# EasyEDA schematic 1-Schematic_Scorpion-256-Turbo_v16.2.4.json
TITLE: Scorpion ZS 256 Turbo +; REV: 16.2.4; Date: 2022-06-06; Sheet: 1/1; Drawn By: Romych; Company: ZX-PK.RU
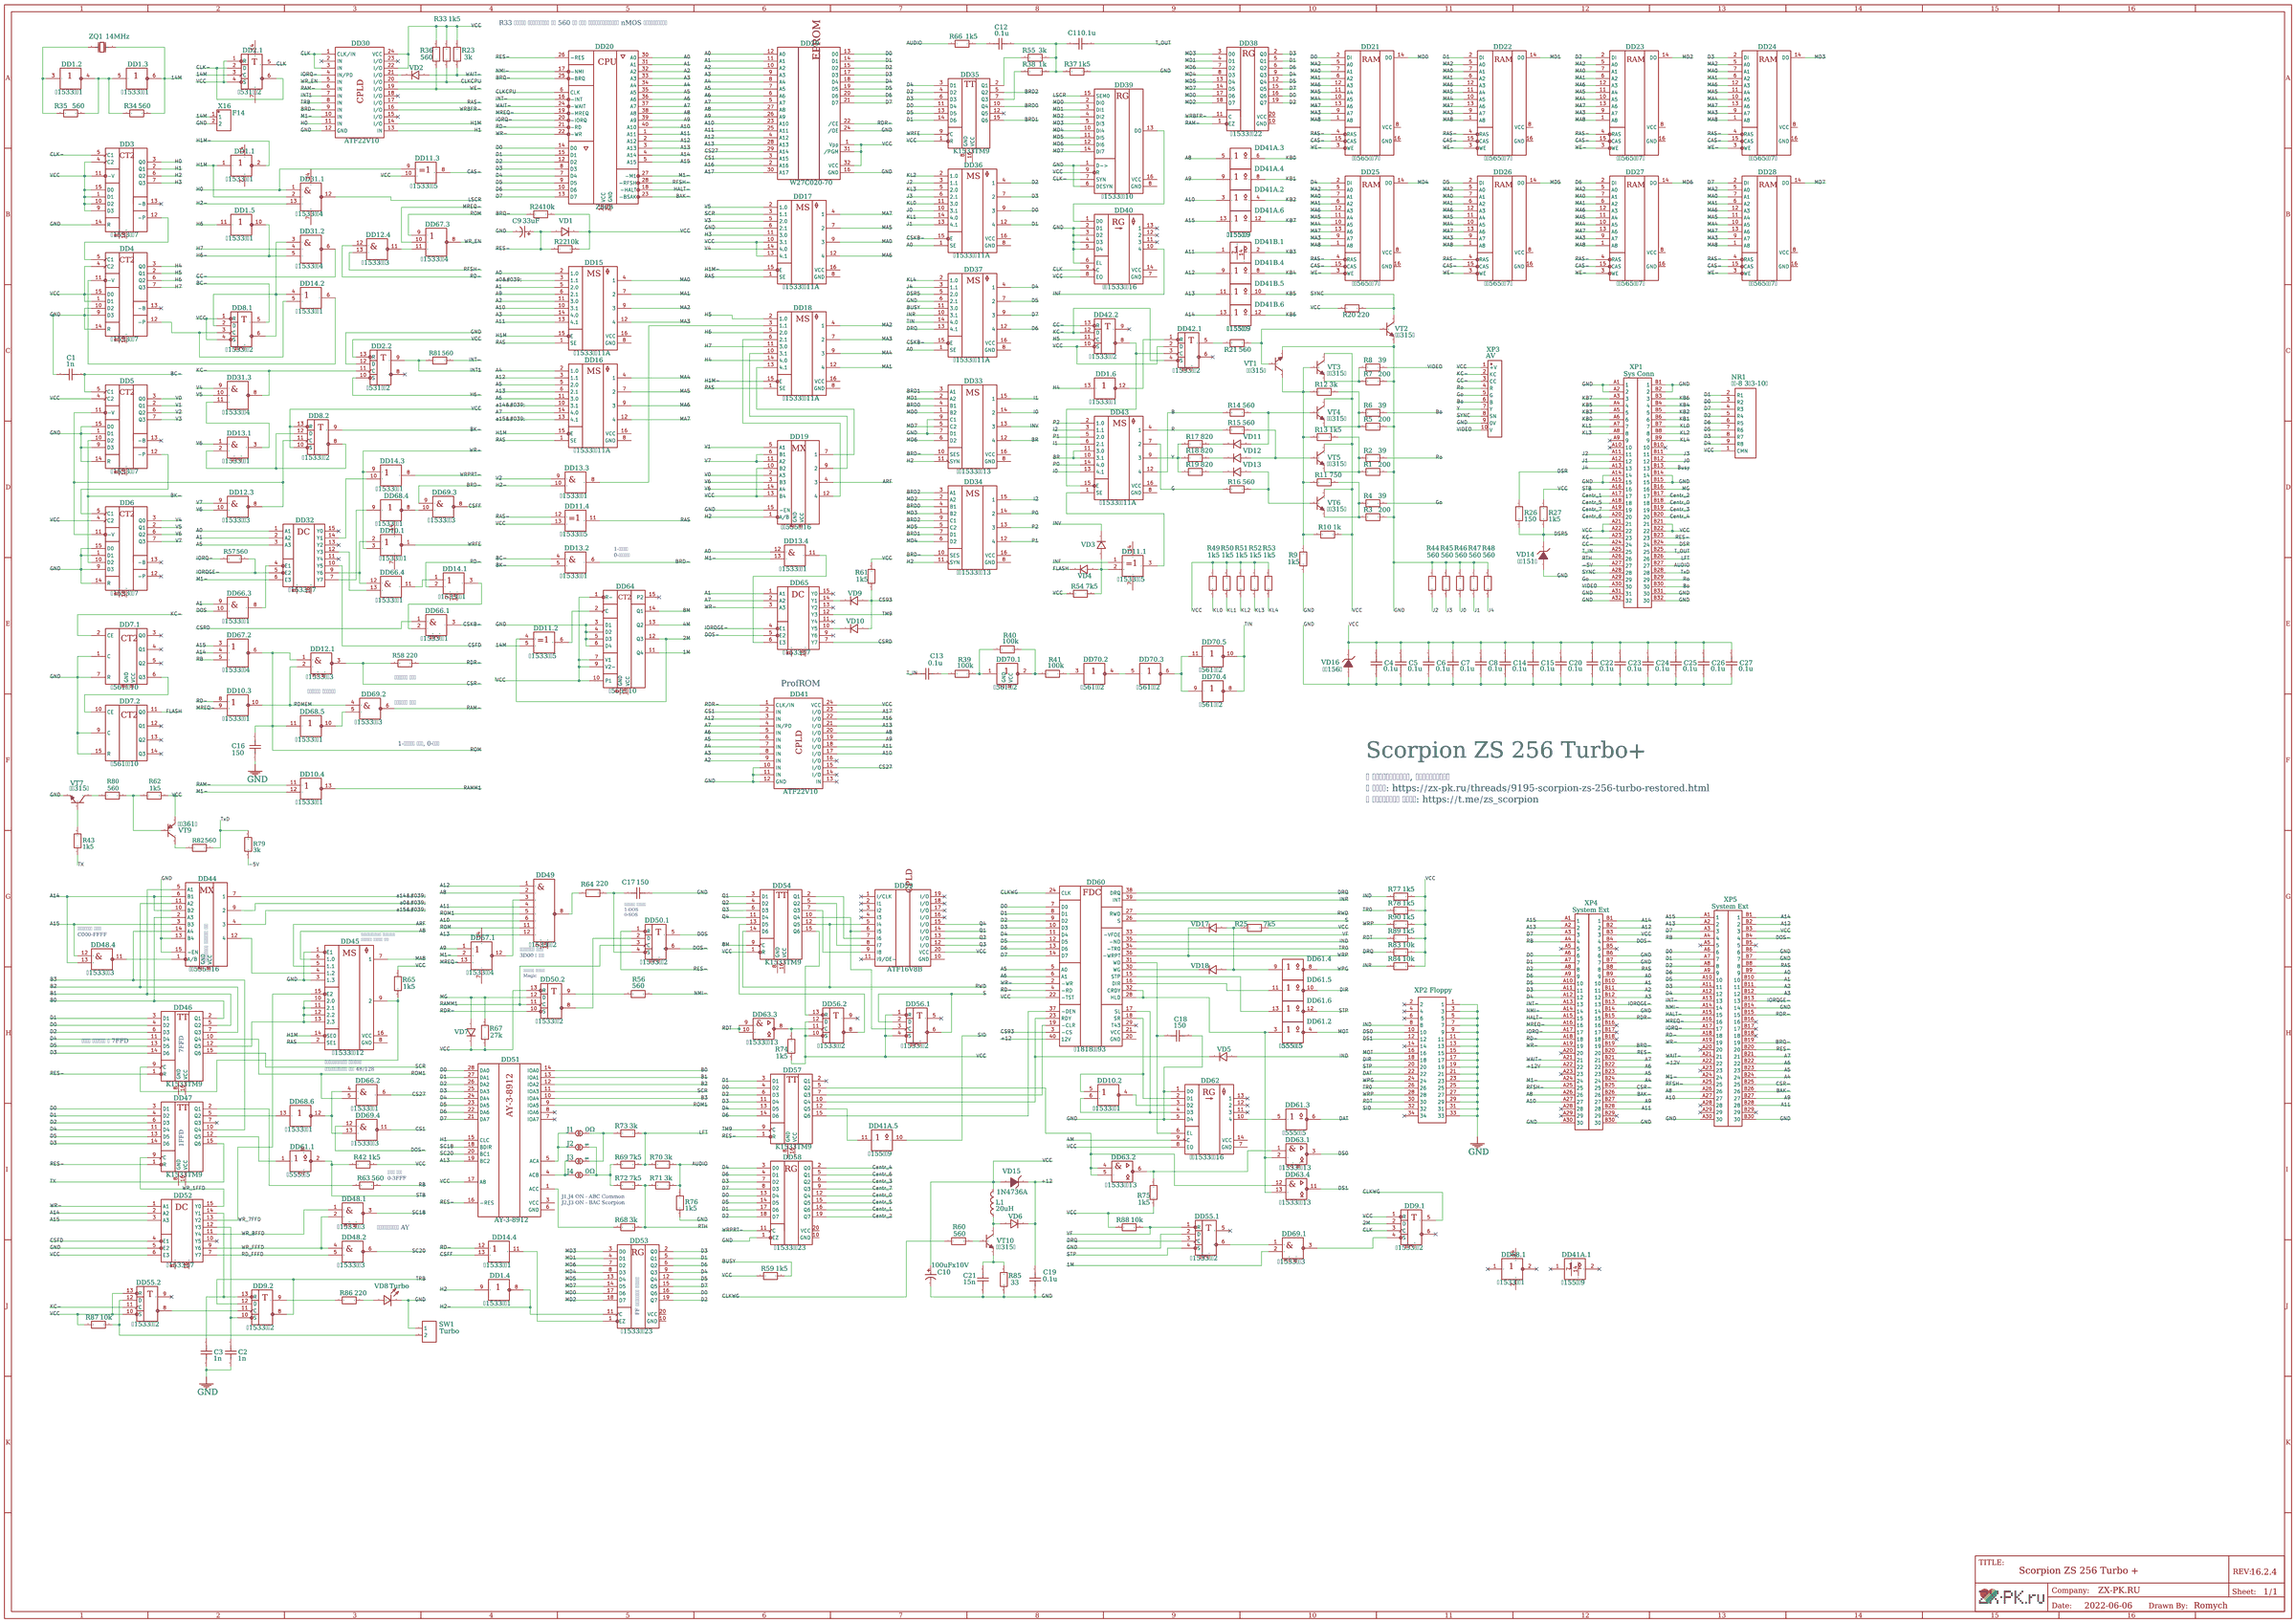
[diagram p0: schematic sheet]

## Parts
C1  1n  [CAP-TH_L5.08]
C2  1n  [CAP-TH_L5.08]
C3  1n  [CAP-TH_L5.08]
C4  0.1u  [CAP-TH_L5.08]
C5  0.1u  [CAP-TH_L5.08]
C6  0.1u  [CAP-TH_L5.08]
C7  0.1u  [CAP-TH_L5.08]
C8  0.1u  [CAP-TH_L5.08]
C9  33uF  [CAP-TH_BD5.0-P2.50-D1.0-FD]
C10  100uFx10V  [CAP-TH_BD6.3-P2.50-D1.0-FD]
C11  0.1u  [CAP-TH_L5.08]
C12  0.1u  [CAP-TH_L5.08]
C13  0.1u  [CAP-TH_L5.08]
C14  0.1u  [CAP-TH_L5.08]
C15  0.1u  [CAP-TH_L5.08]
C16  150  [CAP-TH_L5.08]
C17  150  [CAP-TH_L5.08]
C18  150  [CAP-TH_L5.08]
C19  0.1u  [CAP-TH_L5.08]
C20  0.1u  [CAP-TH_L5.08]
C21  15n  [CAP-TH_L5.08]
C22  0.1u  [CAP-TH_L5.08]
C23  0.1u  [CAP-TH_L5.08]
C24  0.1u  [CAP-TH_L5.08]
C25  0.1u  [CAP-TH_L5.08]
C26  0.1u  [CAP-TH_L5.08]
C27  0.1u  [CAP-TH_L5.08]
DD1  К1533ЛН1  [DIP-14_STD]  (sections 1,2,3,4,5,6)
DD2  К531ТМ2  [DIP-14_STD]  (sections 1,2)
DD3  К1533ИЕ7  [DIP-16_STD]
DD4  К1533ИЕ7  [DIP-16_STD]
DD5  К1533ИЕ7  [DIP-16_STD]
DD6  К1533ИЕ7  [DIP-16_STD]
DD7  К561ИЕ10  [DIP-16_STD]  (sections 1,2)
DD8  К1533ТМ2  [DIP-14_STD]  (sections 1,2)
DD9  К1533ТМ2  [DIP-14_STD]  (sections 1,2)
DD10  К1533ЛЕ1  [DIP-14_STD]  (sections 1,2,3,4)
DD11  К1533ЛП5  [DIP-14_STD]  (sections 1,2,3,4)
DD12  К1533ЛА3  [DIP-14_STD]  (sections 1,3,4)
DD13  К1533ЛИ1  [DIP-14_STD]  (sections 1,2,3,4)
DD14  К1533ЛЛ1  [DIP-14_STD]  (sections 1,2,3,4)
DD15  К1533КП11A  [DIP-16_STD]
DD16  К1533КП11A  [DIP-16_STD]
DD17  К1533КП11A  [DIP-16_STD]
DD18  К1533КП11A  [DIP-16_STD]
DD19  КР555КП16  [DIP-16_STD]
DD20  Z80B  [DIP-40_STD]
DD21  КР565РУ7Г  [DIP-16_STD]
DD22  КР565РУ7Г  [DIP-16_STD]
DD23  КР565РУ7Г  [DIP-16_STD]
DD24  КР565РУ7Г  [DIP-16_STD]
DD25  КР565РУ7Г  [DIP-16_STD]
DD26  КР565РУ7Г  [DIP-16_STD]
DD27  КР565РУ7Г  [DIP-16_STD]
DD28  КР565РУ7Г  [DIP-16_STD]
DD29  W27C020-70  [DIP-32_STD_S]
DD30  ATF22V10  [DIP-24_L30.5-W10.2-P2.54-LS7.62-BL]
DD31  К1533ЛА4  [DIP-14_STD]  (sections 1,2,3)
DD32  К1533ИД7  [DIP-16_STD]
DD33  КР1533КП13  [DIP-16_STD]
DD34  КР1533КП13  [DIP-16_STD]
DD35  K1533TM9  [DIP-16_STD]
DD36  К1533КП11A  [DIP-16_STD]
DD37  К1533КП11A  [DIP-16_STD]
DD38  К1533ИР22  [DIP-20_STD_P7.2]
DD39  К1533ИР10  [DIP-16_STD]
DD40  КР1533ИР16  [DIP-14_STD]
DD41  ATF22V10  [DIP-24_L30.5-W10.2-P2.54-LS7.62-BL]
DD41A.1  К155ЛП9  [DIP-14_STD]
DD41A.2  К155ЛП9  [DIP-14_STD]
DD41A.3  К155ЛП9  [DIP-14_STD]
DD41A.4  К155ЛП9  [DIP-14_STD]
DD41A.5  К155ЛП9  [DIP-14_STD]
DD41A.6  К155ЛП9  [DIP-14_STD]
DD41B.1  К155ЛП9  [DIP-14_STD]
DD41B.4  К155ЛП9  [DIP-14_STD]
DD41B.5  К155ЛП9  [DIP-14_STD]
DD41B.6  К155ЛП9  [DIP-14_STD]
DD42  К1533ТМ2  [DIP-14_STD]  (sections 1,2)
DD43  К1533КП11A  [DIP-16_STD]
DD44  КР555КП16  [DIP-16_STD]
DD45  К1533КП12  [DIP-16_STD]
DD46  K1533TM9  [DIP-16_STD]
DD47  K1533TM9  [DIP-16_STD]
DD48  К1533ЛА3  [DIP-14_STD]  (sections 1,2,4)
DD49  К1533ЛА2  [DIP-14_STD]
DD50  К1533ТМ2  [DIP-14_STD]  (sections 1,2)
DD51  AY-3-8912  [DIP-28_STD]
DD52  К1533ИД7  [DIP-16_STD]
DD53  К1533ИР23  [DIP-20_STD_P7.2]
DD54  K1533TM9  [DIP-16_STD]
DD55  К1533ТМ2  [DIP-14_STD]  (sections 1,2)
DD56  К1533ТМ2  [DIP-14_STD]  (sections 1,2)
DD57  K1533TM9  [DIP-16_STD]
DD58  К1533ИР23  [DIP-20_STD_P7.2]
DD59  ATF16V8B  [DIP-20_STD]
DD60  К1818ВГ93  [DIP-40_STD]
DD61  К555ЛН5  [DIP-14_STD]  (sections 1,2,3,4,5,6)
DD62  КР1533ИР16  [DIP-14_STD]
DD63  К1533ЛА13  [DIP-14_STD]  (sections 1,2,3,4)
DD64  К555ИЕ10  [DIP-16_STD]
DD65  К1533ИД7  [DIP-16_STD]
DD66  К1533ЛИ1  [DIP-14_STD]  (sections 1,2,3,4)
DD67  К1533ЛЕ4  [DIP-14_STD]  (sections 1,2,3)
DD68  К1533ЛН1  [DIP-14_STD]  (sections 1,4,5,6)
DD69  К1533ЛА3  [DIP-14_STD]  (sections 1,2,3,4)
DD70  К561ЛН2  [DIP-14_STD]  (sections 1,2,3,4,5)
J1  0Ω  [JUMP_0603]
J2  ∞  [JUMP_0603]
J3  ∞  [JUMP_0603]
J4  0Ω  [JUMP_0603]
L1  20uH  [L-TH_L5.08]
NR1  НР-8 3к3-10к  [HDR-TH_9P-P2.54-V-F]
R1  200  [R_0.125_7.62]
R2  39  [R_0.125_7.62]
R3  200  [R_0.125_7.62]
R4  39  [R_0.125_7.62]
R5  200  [R_0.125_7.62]
R6  39  [R_0.125_7.62]
R7  200  [R_0.125_7.62]
R8  39  [R_0.125_7.62]
R9  1k5  [R_0.125_7.62]
R10  1k  [R_0.125_7.62]
R11  750  [R_0.125_7.62]
R12  3k  [R_0.125_7.62]
R13  1k5  [R_0.125_7.62]
R14  560  [R_0.125_7.62]
R15  560  [R_0.125_7.62]
R16  560  [R_0.125_7.62]
R17  820  [R_0.125_7.62]
R18  820  [R_0.125_7.62]
R19  820  [R_0.125_7.62]
R20  220  [R_0.125_7.62]
R21  560  [R_0.125_7.62]
R22  10k  [R_0.125_7.62]
R23  3k  [R_0.125_7.62]
R24  10k  [R_0.125_7.62]
R25  7k5  [R_0.125_7.62]
R26  150  [R_0.125_7.62]
R27  1k5  [R_0.125_7.62]
R33  1k5  [R_0.125_7.62]
R34  560  [R_0.125_7.62]
R35  560  [R_0.125_7.62]
R36  560  [R_0.125_7.62]
R37  1k5  [R_0.125_7.62]
R38  1k  [R_0.125_7.62]
R39  100k  [R_0.125_7.62]
R40  100k  [R_0.125_7.62]
R41  100k  [R_0.125_7.62]
R42  1k5  [R_0.125_7.62]
R43  1k5  [R_0.125_7.62]
R44  560  [R_0.125_7.62]
R45  560  [R_0.125_7.62]
R46  560  [R_0.125_7.62]
R47  560  [R_0.125_7.62]
R48  560  [R_0.125_7.62]
R49  1k5  [R_0.125_7.62]
R50  1k5  [R_0.125_7.62]
R51  1k5  [R_0.125_7.62]
R52  1k5  [R_0.125_7.62]
R53  1k5  [R_0.125_7.62]
R54  7k5  [R_0.125_7.62]
R55  3k  [R_0.125_7.62]
R56  560  [R_0.125_7.62]
R57  560  [R_0.125_7.62]
R58  220  [R_0.125_7.62]
R59  1k5  [R_0.125_7.62]
R60  560  [R_0.125_7.62]
R61  1k5  [R_0.125_7.62]
R62  1k5  [R_0.125_7.62]
R63  560  [R_0.125_7.62]
R64  220  [R_0.125_7.62]
R65  1k5  [R_0.125_7.62]
R66  1k5  [R_0.125_7.62]
R67  27k  [R_0.125_7.62]
R68  3k  [R_0.125_7.62]
R69  7k5  [R_0.125_7.62]
R70  3k  [R_0.125_7.62]
R71  3k  [R_0.125_7.62]
R72  7k5  [R_0.125_7.62]
R73  3k  [R_0.125_7.62]
R74  1k5  [R_0.125_7.62]
R75  1k5  [R_0.125_7.62]
R76  1k5  [R_0.125_7.62]
R77  1k5  [R_0.125_7.62]
R78  1k5  [R_0.125_7.62]
R79  3k  [R_0.125_7.62]
R80  560  [R_0.125_7.62]
R81  560  [R_0.125_7.62]
R82  560  [R_0.125_7.62]
R83  10k  [R_0.125_7.62]
R84  10k  [R_0.125_7.62]
R85  33  [R_0.125_7.62]
R86  220  [R_0.125_7.62]
R87  10k  [R_0.125_7.62]
R88  10k  [R_0.125_7.62]
R89  1k5  [R_0.125_7.62]
R90  1k5  [R_0.125_7.62]
SW1  Turbo  [HDR-F-2.54_1X2]
VD1  1N4148  [D_TH_7.62]
VD2  1N4148  [D_TH_7.62]
VD3  1N4148  [D_TH_7.62]
VD4  1N4148  [D_TH_7.62]
VD5  1N4148  [D_TH_7.62]
VD6  1N4148  [D-TH_L10.16]
VD7  1N4148  [D_TH_7.62]
VD8  Turbo  [D-TH_L2.54]
VD9  1N4148  [D-TH_L11.43]
VD10  1N4148  [D_TH_7.62]
VD11  1N4148  [D_TH_7.62]
VD12  1N4148  [D_TH_7.62]
VD13  1N4148  [D_TH_7.62]
VD14  КС151А  [D_TH_7.62]
VD15  1N4736A  [D-TH_L8.89]
VD16  КС156А  [D_TH_7.62]
VD17  1N4148  [D_TH_7.62]
VD18  1N4148  [D_TH_7.62]
VT1  КТ315Б  [KT315_STD]
VT2  КТ315Б  [KT315_STD]
VT3  КТ315Б  [KT315_STD]
VT4  КТ315Б  [KT315_STD]
VT5  КТ315Б  [KT315_STD]
VT6  КТ315Б  [KT315_STD]
VT7  КТ315Б  [KT315_STD]
VT9  КТ361Б  [KT315_STD]
VT10  КТ315Б  [KT315_STD]
X16  F14  [HDR-TH_2P-P2.54-M]
XP1  Sys Conn  [HDR-TH_64P_P2.54_R2]
XP2  Floppy  [IDC-TH_Z-231011834106]
XP3  AV  [HDR-TH_10P-P2.54-V-M]
XP4  System Ext  [SL62_P2.54_R2]
XP5  System Ext  [SL62_P2.54_R2]
ZQ1  14MHz  [OSC-49U-1]

## Library data of the parts
C1-C8 C11-C27 = CK45-R3AD152K-VRY: Supplier: LCSC; Supplier Part: C340608; Manufacturer: TDK; Contributor: LCSC
C9 C10 = ECLJ0612220M101P00: Supplier: LCSC; Supplier Part: C156809; Manufacturer: Guangdong TOPAZ Elec Tech; Contributor: LCSC
DD1 DD68 = К1533ЛН1: Supplier: chipdip; Contributor: Roman Boykov; subpart_no: 7
DD2 = К531ТМ2: Supplier: chipdip; Contributor: Roman Boykov; subpart_no: 1
DD3-DD6 = К1533ИЕ7: Contributor: romychs_4693
DD7 = К561ИЕ10: Supplier: chipdip; Contributor: romychs_4693; subpart_no: 1
DD8 DD9 DD42 DD50 DD55 DD56 = К1533ТМ2: Supplier: chipdip; Contributor: romychs_4693; subpart_no: 3
DD10 = К1533ЛЕ1: Supplier: chipdip; Contributor: Roman Boykov; subpart_no: 1
DD11 = К1533ЛП5: Supplier: chipdip; Contributor: Roman Boykov; subpart_no: 1
DD12 DD48 DD69 = К1533ЛА3: Supplier: chipdip; Contributor: Roman Boykov; subpart_no: 1
DD13 DD66 = К1533ЛИ1: Supplier: chipdip; Contributor: Roman Boykov; subpart_no: 1
DD14 = К1533ЛЛ1: Supplier: chipdip; Contributor: Roman Boykov; subpart_no: 1
DD15-DD18 DD36 DD37 DD43 = К1533КП11A: Supplier: chipdip; Contributor: Roman Boykov
DD19 DD44 = КР555КП16: Supplier: chipdip; Contributor: romychs_4693
DD20 = Z80B: Manufacturer: Zilog; Contributor: romychs_4693
DD21-DD28 = КР565РУ7Г: Supplier: chipdip; Contributor: Roman Boykov
DD29 = W27C020-70: Contributor: romychs_4693
DD30 DD41 = ATF22V10: Manufacturer: Microchip; Contributor: romychs_4693
DD31 = К1533ЛА4: Supplier: chipdip; Contributor: Roman Boykov; subpart_no: 1
DD32 DD52 DD65 = К1533ИД7: Supplier: chipdip; Contributor: romychs_4693; subpart_no: 4
DD33 DD34 = КР1533КП13: Supplier: chipdip; Contributor: romychs_4693
DD35 DD46 DD47 DD54 DD57 = K1533TM9: Supplier: chipdip; Contributor: Roman Boykov
DD38 = К1533ИР22: Supplier: chipdip; link: TTL; Регистр; ИР22; Contributor: Roman Boykov
DD39 = К1533ИР10: Supplier: chipdip; link: TTL; Регистр; ИР23; Contributor: Roman Boykov
DD40 DD62 = КР1533ИР16: Supplier: chipdip; Contributor: romychs_4693
DD41A.1-DD41A.4 DD41A.6 DD41B.1 DD41B.4 DD41B.5 = К155ЛП9: Supplier: chipdip; Contributor: Roman Boykov; subpart_no: 2
DD41A.5 = К155ЛП9: Supplier: chipdip; Contributor: Roman Boykov; subpart_no: 5
DD41B.6 = К155ЛП9: Supplier: chipdip; Contributor: Roman Boykov; subpart_no: 6
DD45 = К1533КП12: Supplier: chipdip; Contributor: romychs_4693
DD49 = К1533ЛА2: Supplier: chipdip; Contributor: Roman Boykov
DD51 = AY-3-8912: Supplier: chipdip; Contributor: romychs_4693
DD53 DD58 = К1533ИР23: Supplier: chipdip; link: TTL; Регистр; ИР23; Contributor: romychs_4693
DD59 = ATF16V8B: Manufacturer: Microchip; Contributor: romychs_4693
DD60 = К1818ВГ93: link: ВГ93; FDD; Contributor: Roman Boykov
DD61 = К555ЛН5: Supplier: chipdip; Contributor: Roman Boykov; subpart_no: 7
DD63 = К1533ЛА13: Supplier: chipdip; Contributor: Roman Boykov; subpart_no: 1
DD64 = К555ИЕ10: Contributor: romychs_4693
DD67 = К1533ЛЕ4: Supplier: chipdip; Contributor: Roman Boykov; subpart_no: 1
DD70 = К561ЛН2: Supplier: chipdip; Contributor: romychs_4693; subpart_no: 1
J1-J4 = Jumper 0603: Contributor: Roman Boykov
L1 = LGA0510-101KP52E: Supplier: LCSC; Manufacturer: FH; Supplier Part: C71328
NR1 = НР-8: Supplier: chipdip; Contributor: Roman Boykov
R1-R27 R33-R90 = RN 1/8W 470R F T/B A1: Supplier: LCSC; Supplier Part: C433478; Manufacturer: TyoHM; Contributor: LCSC
SW1 = HDR-F-2.54_1x2: Supplier Part: C49661; Supplier: LCSC; Contributor: LCEDA_Lib
VD1-VD7 VD9-VD13 VD17 VD18 = 1N4148: Contributor: EasyEDA
VD8 = LED-0603_R: Manufacturer: EVERLIGHT(台湾亿光); Manufacturer Part: 19-217/R6C-AL1M2VY/3T; Supplier Part: C72044; Supplier: LCSC; Contributor: LCEDA_01
VD14 VD16 = 1N4742A: Supplier: LCSC; Manufacturer: Tak Cheong; Supplier Part: C113210; JLCPCB Part Class: Extended Part
VD15 = 1N4742A: Supplier: LCSC; Manufacturer: Tak Cheong; Supplier Part: C113210
VT1-VT7 VT10 = 2SC1815-TA: Supplier: LCSC; Manufacturer: CJ; image: //image.lceda.cn/szlcsc/C41114.jpg; Supplier Part: C41114
VT9 = 2SA1015-TA: Supplier: LCSC; Supplier Part: C160132; Manufacturer: Changjiang Electronics Tech (CJ); Contributor: LCSC
X16 = 54102-T0600LF: Supplier: LCSC; Supplier Part: C213465; Manufacturer: Amphenol ICC; Contributor: LCSC
XP1 = PinHeader_2x32: Contributor: Roman Boykov
XP2 = Z-231011834106: Supplier: LCSC; Supplier Part: C221069; Manufacturer: Nextronics Engineering; Contributor: LCSC
XP3 = X6511WV-10H-C30D60: Supplier: LCSC; Supplier Part: C706882; Manufacturer: XKB Connectivity; Contributor: LCSC; LCSC Assembly: Yes; SMT Type: Extend
XP4 XP5 = PinHeader_2x30: Contributor: Roman Boykov
ZQ1 = X49UD12MSD2SC: Supplier: LCSC; Manufacturer: YXC; Supplier Part: C2188

## Nets
+12V: XP4.A22(22) XP5.A22(22)
-5V: R79.1 XP1.A27(27)
GND: C1.2 C2.2 C3.2 C4.1 C5.1 C6.1 C7.1 C8.1 C9.2 C10.2 C14.1 C15.1 C16.1 C17.1 C18.2 C19.2 C20.1 C21.2 C22.1 C23.1 C24.1 C25.1 C26.1 C27.1 DD2.12(D) DD3.14(R) DD4.9(D3) DD4.10(D2) DD4.14(R) DD5.1(D1) DD5.9(D3) DD5.14(R) DD5.15(D0) DD6.1(D1) DD6.9(D3) DD6.14(R) DD6.15(D0) DD7.1(C) DD7.7(R) DD7.9(C) DD7.15(R) DD17.6(2.1) DD19.15(-EN) DD29.16(GND) DD29.24(/OE) DD30.12(GND) DD33.7(D1) DD33.9(C1) DD37.6(2.1) DD39.1(D->) DD39.6(DESYN) DD40.2(D1) DD40.3(D2) DD40.4(D3) DD40.5(D4) DD40.6(EL) DD41.10(IN) DD41.11(IN) DD41.12(GND) DD44.13(B4) DD44.15(-EN) DD45.1(E1) DD45.3(1.3) DD52.5(E2) DD55.2(D) DD58.1(EZ) DD62.1(D0) DD62.5(D4) DD64.3(D1) DD64.4(D2) DD64.5(D3) DD64.6(D4) R1.1 R3.1 R5.1 R7.1 R9.2 R37.1 R44.1 R45.1 R46.1 R47.1 R48.1 R76.2 R85.1 SW1.1 VD8.2 VD14.1(A) VD16.1(A) VT1.1(E) VT2.1(E) VT7.1(E) X16.2 XP1.A1(1) XP1.A2(2) XP1.A14(14) XP1.A15(15) XP1.A31(31) XP1.A32(32) XP1.B1(1) XP1.B2(2) XP1.B14(14) XP1.B15(15) XP1.B31(30) XP1.B32(30) XP2.1 XP2.3 XP2.5 XP2.7 XP2.9 XP2.11 XP2.13 XP2.15 XP2.17 XP2.19 XP2.21 XP2.23 XP2.25 XP2.27 XP2.29 XP2.31 XP2.33 XP3.9(0V) XP4.A30(30) XP4.B6(6) XP4.B7(7) XP4.B14(14) XP4.B30(30) XP5.A30(30) XP5.B6(6) XP5.B7(7) XP5.B14(14) XP5.B30(30)
V0: DD5.3(Q0) DD19.2(A3)
V1: DD5.2(Q1) DD19.5(A1)
V2: DD5.6(Q2) DD13.9(1)
V3: DD5.7(Q3) DD17.5(2.0)
V4: DD6.3(Q0) DD17.14(4.0) DD31.9(I1)
V5: DD6.2(Q1) DD17.2(1.0) DD31.10(I2)
V6: DD6.6(Q2) DD12.10(2) DD13.1 DD19.3(B3) DD19.14(A4)
V7: DD6.7(Q3) DD12.9(1) DD19.6(B1) DD19.11(A2)
VCC: C4.2 C5.2 C6.2 C7.2 C8.2 C10.1 C14.2 C15.2 C20.2 C22.2 C23.2 C24.2 C25.2 C26.2 C27.2 DD2.1(R) DD2.4(S) DD2.13(R) DD3.1(D1) DD3.4(C2) DD3.9(D3) DD3.10(D2) DD3.11(-V) DD3.15(D0) DD4.1(D1) DD4.4(C2) DD4.15(D0) DD5.4(C2) DD6.4(C2) DD8.1(R) DD8.4(S) DD8.10(S) DD8.13(R) DD9.1(R) DD11.10(2) DD11.13(2) DD17.10(3.1) DD17.13(4.1) DD19.10(B2) DD19.13(B4) DD29.1(Vpp) DD29.31(/PGM) DD29.32(VCC) DD30.22(I/O) DD30.24(VCC) DD35.1(R) DD39.9(R) DD40.8(EO) DD41.24(VCC) DD42.2(D) DD42.10(S) DD50.13(R) DD51.17(A8) DD52.6(E3) DD54.1(R) DD55.10(S) DD55.13(R) DD56.1(R) DD56.4(S) DD56.10(S) DD56.12(D) DD59.20(VCC) DD60.22(-TST) DD62.8(EO) DD64.1(R-) DD64.7(V1) DD64.9(V2-) DD64.10(P1) L1.2 NR1.1(CMN) R10.1 R20.2 R22.2 R23.2 R24.2 R25.2 R27.1 R33.2 R36.2 R42.2 R49.1 R50.1 R51.1 R52.1 R53.1 R54.2 R59.1 R61.2 R62.2 R65.1 R67.1 R74.2 R75.2 R77.2 R78.2 R83.2 R84.2 R87.2 R88.1 R89.2 R90.2 VD1.2(K) VD7.2(K) VD15.1(A) VD16.2(K) VT3.2(C) VT4.2(C) VT5.2(C) VT6.2(C) VT9.1(E) XP1.A21(21) XP1.A22(22) XP1.B21(21) XP1.B22(22) XP3.1(+V) XP4.B3(3) XP5.B3(3)
1M: DD64.11(Q4) DD69.2
2M: DD9.2(D) DD11.4(1) DD64.12(Q3)
4M: DD62.9(C) DD64.13(Q2)
8M: DD54.9(C) DD64.14(Q1)
14M: DD1.6(2) DD2.3(С) DD11.5(2) R34.2 X16.1 ZQ1.1(OSC1)
+12: C19.1 DD60.40(12V) VD6.2(K) VD15.2(K)
A0: DD13.12(1) DD15.2(1.0) DD20.30(A0) DD29.12(A0) DD32.1(A1) DD36.1(SE) DD37.1(SE) XP4.B9(9) XP5.B9(9)
a0&#039;: DD15.3(1.1) DD44.9(2)
A1: DD15.5(2.0) DD20.31(A1) DD29.11(A1) DD32.2(A2) DD65.1(A1) DD66.9(1) XP4.B10(10) XP5.B10(10)
A2: DD15.11(3.0) DD20.32(A2) DD29.10(A2) DD41.9(IN) XP4.B11(11) XP5.B11(11)
A3: DD15.14(4.0) DD20.33(A3) DD29.9(A3) DD41.8(IN) XP4.B12(12) XP5.B12(12)
A4: DD16.2(1.0) DD20.34(A4) DD29.8(A4) DD41.7(IN) XP4.B24(24) XP5.B24(24)
A5: DD16.5(2.0) DD20.35(A5) DD29.7(A5) DD32.3(A3) DD41.6(IN) DD60.5(A0) XP4.B23(23) XP5.B23(23)
A6: DD16.11(3.0) DD20.36(A6) DD29.6(A6) DD41.5(IN) DD60.6(A1) XP4.B22(22) XP5.B22(22)
A7: DD16.14(4.0) DD20.37(A7) DD29.5(A7) DD41.4(IN/PD) DD65.2(A2) XP4.B21(21) XP5.B21(21)
A8: DD20.38(A8) DD29.27(A8) DD41.20(I/O) DD41A.3.5(1) DD45.6(1.0) DD49.2 XP4.A26(26) XP5.A26(26)
A9: DD15.6(2.1) DD20.39(A9) DD29.26(A9) DD41.19(I/O) DD41A.4.9(1) DD67.1(I1) XP4.B27(27) XP5.B27(27)
A10: DD15.10(3.1) DD20.40(A10) DD29.23(A10) DD41.17(I/O) DD41A.2.3(1) DD49.6 XP4.A27(27) XP5.A27(27)
A11: DD15.13(4.1) DD20.1(A11) DD29.25(A11) DD41.18(I/O) DD41B.1.1 DD49.4 XP4.B28(28) XP5.B28(28)
A12: DD16.3(1.1) DD20.2(A12) DD29.4(A12) DD41.3(IN) DD41B.4.9(1) DD49.1 XP4.B2(2) XP5.B2(2)
A13: DD16.6(2.1) DD20.3(A13) DD29.28(A13) DD41.21(I/O) DD41B.5.11(1) DD49.12(8) DD51.19(BC2) XP4.A2(2) XP5.A2(2)
A14: DD20.4(A14) DD41B.6.13(1) DD44.6(B1) DD44.10(B2) DD48.13(2) DD52.2(A2) DD67.4(I2) XP4.B1(1) XP5.B1(1)
a14&#039;: DD16.10(3.1) DD44.7(1)
A15: DD20.5(A15) DD41A.6.13(1) DD44.3(B3) DD48.12(1) DD52.3(A3) DD67.3(I1) XP4.A1(1) XP5.A1(1)
a15&#039;: DD16.13(4.1) DD44.4(3)
A16: DD29.2(A16) DD41.22(I/O)
A17: DD29.30(A17) DD41.23(I/O)
ARF: DD19.4(3) DD45.5(1.1)
AUDIO: R66.2 R70.1 R71.1 R76.1 XP1.B27(27)
B: DD43.12(4) R14.2
B0: DD44.2(A3) DD46.2(Q1) DD51.14(IOA0)
B1: DD44.5(A1) DD46.5(Q2) DD51.13(IOA1)
B2: DD44.11(A2) DD46.7(Q3) DD51.12(IOA2)
B3: DD44.14(A4) DD47.10(Q4) DD51.10(IOA4)
BAK-: DD20.23(-BSAK) XP4.B26(26) XP5.B26(26)
BC-: C1.1 DD5.5(C1) DD8.5(Q) DD13.4(1)
BK-: DD5.10(D2) DD6.10(D2) DD8.9(Q) DD13.5(2)
Bo: R6.1 XP1.B30(30) XP3.6(B)
BR: DD33.12(4) DD43.10(3.1) DD43.11(3.0)
BRD0: DD33.4(B1) DD34.4(B1) DD35.10(Q4)
BRD1: DD33.3(A1) DD34.7(D1) DD35.15(Q6)
BRD2: DD34.3(A1) DD34.9(C1) DD35.5(Q2)
BRD-: DD13.6(3) DD30.9(IN) DD33.10(SES) DD34.10(SES) DD69.9(1)
BRQ-: DD20.25(-BRQ) R24.1 XP4.B19(19) XP5.B19(19)
BUSY: DD37.11(3.0) R59.2
Busy: XP1.B13(13)
CAS-: DD11.8(3) DD21.15(CAS) DD22.15(CAS) DD23.15(CAS) DD24.15(CAS) DD25.15(CAS) DD26.15(CAS) DD27.15(CAS) DD28.15(CAS)
CC-: DD31.6(O) DD42.13(R) XP1.A24(24) XP3.3(CC)
Centr_0: DD58.12(Q4) XP1.B18(18)
Centr_1: DD58.16(Q6) XP1.A17(17)
Centr_2: DD58.19(Q7) XP1.B17(17)
Centr_3: DD58.6(Q2) XP1.B19(19)
Centr_4: DD58.2(Q0) XP1.B20(20)
Centr_5: DD58.15(Q5) XP1.A18(18)
Centr_6: DD58.5(Q1) XP1.A20(20)
Centr_7: DD58.9(Q3) XP1.A19(19)
CLK: DD2.5(Q) DD9.3(С) DD30.1(CLK/IN) DD30.3(IN) DD40.9(C)
CLK-: DD2.2(D) DD2.6(&#126;Q) DD3.5(C1) DD39.7(SYN)
CLKCPU: DD20.6(CLK) DD30.20(I/O) R33.1
CLKWG: DD9.5(Q) DD60.24(CLK) R60.1
CS1: DD29.3(A15) DD41.2(IN) DD69.11(3)
CS27: DD29.29(A14) DD41.15(I/O) DD66.6(3)
CS93: DD60.3(-CS) R61.1 VD9.1(A) VD10.1(A)
CSFD: DD32.10(Y5) DD52.4(E1)
CSFF: DD14.13(2) DD69.8(3)
CSKB-: DD36.15(E) DD37.15(E) DD66.3
CSR-: DD12.3 R58.2 XP4.B25(25) XP5.B25(25)
CSRD: DD65.7(Y7) DD66.1
D0: DD20.14(D0) DD21.2(DI) DD29.13(D0) DD35.11(D4) DD36.9(3) DD38.16(Q6) DD46.4(D2) DD47.3(D1) DD51.28(DA0) DD53.16(Q6) DD57.4(D2) DD58.13(D4) DD60.7(D0) NR1.3(R2) XP4.A6(6) XP5.A6(6)
D1: DD20.15(D1) DD22.2(DI) DD29.14(D1) DD35.14(D6) DD36.12(4) DD38.5(Q1) DD46.3(D1) DD47.4(D2) DD51.27(DA1) DD53.5(Q1) DD57.3(D1) DD58.17(D6) DD60.8(D1) NR1.2(R1) XP4.A7(7) XP5.A7(7)
D2: DD20.12(D2) DD23.2(DI) DD29.15(D2) DD35.4(D2) DD36.4(1) DD38.19(Q7) DD46.6(D3) DD47.6(D3) DD51.26(DA2) DD53.19(Q7) DD57.6(D3) DD58.18(D7) DD60.9(D2) NR1.5(R4) XP4.A8(8) XP5.A8(8)
D3: DD20.8(D3) DD24.2(DI) DD29.17(D3) DD35.6(D3) DD36.7(2) DD38.2(Q0) DD46.14(D6) DD47.14(D6) DD51.25(DA3) DD53.2(Q0) DD57.11(D4) DD58.7(D2) DD60.10(D3) NR1.8(R7) XP4.A11(11) XP5.A11(11)
D4: DD20.7(D4) DD25.2(DI) DD29.18(D4) DD35.3(D1) DD37.4(1) DD38.9(Q3) DD46.11(D4) DD47.11(D4) DD51.24(DA4) DD53.9(Q3) DD57.13(D5) DD58.3(D0) DD60.11(D4) NR1.9(R8) XP4.A12(12) XP5.A12(12)
D5: DD20.9(D5) DD26.2(DI) DD29.19(D5) DD35.13(D5) DD37.7(2) DD38.12(Q4) DD46.13(D5) DD47.13(D5) DD51.23(DA5) DD53.12(Q4) DD58.14(D5) DD60.12(D5) NR1.7(R6) XP4.A10(10) XP5.A10(10)
D6: DD20.10(D6) DD27.2(DI) DD29.20(D6) DD37.12(4) DD38.6(Q2) DD51.22(DA6) DD53.6(Q2) DD57.14(D6) DD58.4(D1) DD60.13(D6) NR1.6(R5) XP4.A9(9) XP5.A9(9)
D7: DD20.13(D7) DD28.2(DI) DD29.21(D7) DD37.9(3) DD38.15(Q5) DD51.21(DA7) DD53.15(Q5) DD58.8(D3) DD60.14(D7) NR1.4(R3) XP4.A3(3) XP5.A3(3)
DAT: DD61.6(2) XP2.22
DIR: DD61.10(2) XP2.18
DOS: DD50.5(Q) DD66.10(2)
DOS-: DD50.6(&#126;Q) DD65.5(E2) DD69.12(1) XP4.B4(4) XP5.B4(4)
DRQ: DD37.13(4.1) DD55.3(С) DD60.38(DRQ) R83.1
DS0: DD63.3 XP2.10
DS1: DD63.11(3) XP2.12
DSR: R26.1 XP1.B24(24)
DSR5: DD37.5(2.0) R26.2 R27.2 VD14.2(K)
FLASH: DD7.11(Q0) VD4.2(K)
G: DD43.7(2) R16.2
Go: R4.1 XP1.A29(29) XP3.5(G)
H0: DD3.3(Q0) DD11.9(1) DD30.11(IN) DD31.1(I1)
H1: DD3.2(Q1) DD30.13(IN) DD51.15(CLC)
H1M: DD1.1 DD15.15(E) DD16.15(E) DD30.14(I/O) DD31.2(I2) DD45.14(SE0)
H1M-: DD1.2 DD17.15(E) DD18.15(E)
H2: DD1.9(1) DD3.6(Q2) DD19.1(A/B) DD33.11(SYN) DD34.11(SYN)
H2-: DD1.8(2) DD13.10(2) DD31.13(I3) DD53.11(C)
H3: DD3.7(Q3) DD17.11(3.0)
H4: DD1.13(1) DD4.3(Q0) DD18.14(4.0)
H5: DD4.2(Q1) DD18.2(1.0) DD42.11(C)
H6: DD1.11(1) DD4.6(Q2) DD18.5(2.0)
H6-: DD1.10(2) DD2.10(S) DD31.5(I3)
H7: DD4.7(Q3) DD18.11(3.0) DD31.4(I2)
HALT-: DD20.18(-HALT) XP4.A15(15) XP5.A15(15)
I0: DD33.14(2) DD43.13(4.1)
I1: DD33.15(1) DD43.6(2.1)
I2: DD34.15(1) DD43.3(1.1)
IND: DD60.35(-ND) R77.1 VD5.1(A) XP2.8
INF: DD11.1 DD40.10(4)
INR: DD37.10(3.1) DD60.39(INT) R84.1
INT1: DD2.9(Q) DD30.7(IN) R81.1
INT-: DD20.16(-INT) R81.2 XP4.A13(13) XP5.A13(13)
INV: DD33.13(3) VD3.2(K)
IORQ-: DD20.20(-IORQ) DD30.4(IN/PD) R57.1 XP4.A17(17) XP5.A17(17)
IORQGE-: DD32.5(E2) DD65.4(E1) R57.2 XP4.B13(13) XP5.B13(13)
J0: DD36.10(3.1) R46.2 XP1.B12(12)
J1: DD36.13(4.1) R47.2 XP1.A12(12)
J2: DD36.3(1.1) R44.2 XP1.A11(11)
J3: DD36.6(2.1) R45.2 XP1.B11(11)
J4: DD37.3(1.1) R48.2 XP1.A13(13)
KB0: DD41A.3.6(2) XP1.A6(6)
KB1: DD41A.4.8(2) XP1.B6(6)
KB2: DD41A.2.4(2) XP1.B5(5)
KB3: DD41B.1.2 XP1.A5(5)
KB4: DD41B.4.8(2) XP1.B4(4)
KB5: DD41B.5.10(2) XP1.A4(4)
KB6: DD41B.6.12(2) XP1.B3(3)
KB7: DD41A.6.12(2) XP1.A3(3)
KC-: DD2.11(С) DD7.2(CE) DD31.8(O) DD42.4(S) DD42.12(D) DD55.11(C) XP1.A23(23) XP3.2(KC)
KL0: DD36.11(3.0) R49.2 XP1.B7(7)
KL1: DD36.14(4.0) R50.2 XP1.A7(7)
KL2: DD36.2(1.0) R51.2 XP1.B8(8)
KL3: DD36.5(2.0) R52.2 XP1.A8(8)
KL4: DD37.2(1.0) R53.2 XP1.B9(9)
LFT: R69.1 R70.2 R73.1 XP1.B26(26)
LSCR: DD31.12(O) DD39.15(SEM0)
M1-: DD10.12(2) DD13.13(2) DD20.27(-M1) DD30.10(IN) DD32.6(E3) DD67.2(I2) XP4.A24(24) XP5.A24(24)
MA0: DD15.4(1) DD17.9(3) DD21.7(A1) DD22.7(A1) DD23.7(A1) DD24.7(A1) DD25.7(A1) DD26.7(A1) DD27.7(A1) DD28.7(A1)
MA1: DD15.7(2) DD18.12(4) DD21.6(A2) DD22.6(A2) DD23.6(A2) DD24.6(A2) DD25.6(A2) DD26.6(A2) DD27.6(A2) DD28.6(A2)
MA2: DD15.9(3) DD18.4(1) DD21.5(A0) DD22.5(A0) DD23.5(A0) DD24.5(A0) DD25.5(A0) DD26.5(A0) DD27.5(A0) DD28.5(A0)
MA3: DD15.12(4) DD18.7(2) DD21.9(A7) DD22.9(A7) DD23.9(A7) DD24.9(A7) DD25.9(A7) DD26.9(A7) DD27.9(A7) DD28.9(A7)
MA4: DD16.4(1) DD18.9(3) DD21.10(A5) DD22.10(A5) DD23.10(A5) DD24.10(A5) DD25.10(A5) DD26.10(A5) DD27.10(A5) DD28.10(A5)
MA5: DD16.7(2) DD17.7(2) DD21.11(A4) DD22.11(A4) DD23.11(A4) DD24.11(A4) DD25.11(A4) DD26.11(A4) DD27.11(A4) DD28.11(A4)
MA6: DD16.9(3) DD17.12(4) DD21.12(A3) DD22.12(A3) DD23.12(A3) DD24.12(A3) DD25.12(A3) DD26.12(A3) DD27.12(A3) DD28.12(A3)
MA7: DD16.12(4) DD17.4(1) DD21.13(A6) DD22.13(A6) DD23.13(A6) DD24.13(A6) DD25.13(A6) DD26.13(A6) DD27.13(A6) DD28.13(A6)
MA8: DD21.1(A8) DD22.1(A8) DD23.1(A8) DD24.1(A8) DD25.1(A8) DD26.1(A8) DD27.1(A8) DD28.1(A8) DD45.7(1)
MD0: DD21.14(DO) DD33.1(B2) DD38.17(D6) DD39.2(DI0) DD53.17(D6)
MD1: DD22.14(DO) DD33.2(A2) DD38.4(D1) DD39.3(DI1) DD53.4(D1)
MD2: DD23.14(DO) DD34.2(A2) DD38.18(D7) DD39.4(DI2) DD53.18(D7)
MD3: DD24.14(DO) DD34.1(B2) DD38.3(D0) DD39.5(DI3) DD53.3(D0)
MD4: DD25.14(DO) DD34.6(D2) DD38.8(D3) DD39.10(DI4) DD53.8(D3)
MD5: DD26.14(DO) DD34.5(C2) DD38.13(D4) DD39.11(DI5) DD53.13(D4)
MD6: DD27.14(DO) DD33.6(D2) DD38.7(D2) DD39.12(DI6) DD53.7(D2)
MD7: DD28.14(DO) DD33.5(C2) DD38.14(D5) DD39.14(DI7) DD53.14(D5)
MG: DD50.12(D) R67.2 VD7.1(A) XP1.B16(16)
MOT: DD61.4(2) XP2.16
MREQ-: DD10.9(2) DD20.19(-MREQ) DD67.10(I2) DD67.13(I3) XP4.A16(16) XP5.A16(16)
NMI-: DD20.17(-NMI) R56.1 XP4.A14(14) XP5.A14(14)
P0: DD34.14(2) DD43.14(4.0)
P1: DD34.12(4) DD43.5(2.0)
P2: DD34.13(3) DD43.2(1.0)
Q1: DD54.3(D1) DD59.14(I/O)
Q2: DD54.4(D2) DD59.13(I/O)
Q3: DD54.6(D3) DD59.12(I/O)
Q4: DD54.11(D4) DD59.15(I/O)
R: DD43.4(1) R15.2
RAM-: DD10.11(1) DD30.6(IN) DD38.1(EZ) DD69.6(3)
RAMM1: DD10.13(3) DD50.3(С) DD50.11(C)
RAS: DD11.11(3) DD15.1(SE) DD16.1(SE) DD17.1(SE) DD18.1(SE) DD45.2(SE1) XP4.B8(8) XP5.B8(8)
RAS-: DD11.12(1) DD21.4(RAS) DD22.4(RAS) DD23.4(RAS) DD24.4(RAS) DD25.4(RAS) DD26.4(RAS) DD27.4(RAS) DD28.4(RAS) DD30.17(I/O)
RB: DD67.5(I3) R63.2 XP4.A4(4) XP5.A4(4)
RD-: DD10.8(1) DD12.12(1) DD14.2 DD14.12(1) DD20.21(-RD) DD60.4(-RD) XP4.A18(18) XP5.A18(18)
RD_FFFD: DD48.5(2) DD52.7(Y7)
RDMEM: DD10.10(3) DD12.2 DD69.4(1)
RDR-: DD29.22(/CE) DD41.1(CLK/IN) DD50.10(S) R58.1 XP4.B15(15) XP5.B15(15)
RDT: DD63.9(1) DD63.10(2) R89.1 XP2.30
RES-: C9.1 DD20.26(-RES) DD46.1(R) DD47.1(R) DD50.1(R) DD51.16(-RES) DD57.1(R) R22.1 VD1.1(A) XP1.B23(23) XP4.B20(20) XP5.B20(20)
RFSH-: DD12.13(2) DD20.28(-RFSH) XP4.A25(25) XP5.A25(25)
Ro: R2.1 XP1.B29(29) XP3.4(R)
ROM: C16.2 DD12.1 DD49.11(7) DD67.6(O) DD67.9(I1) DD68.11(1)
ROM1: DD46.10(Q4) DD49.5 DD51.9(IOA5) DD66.5(2)
RTH: R68.1 R71.2 R72.1 XP1.A26(26)
RWD: DD54.12(Q5) DD54.14(D6) DD59.5(I4) DD60.27(RWD)
S: DD56.2(D) DD56.6(&#126;Q) DD60.26(S)
SC18: DD48.3 DD51.18(BDIR)
SC20: DD48.6(3) DD51.20(BC1)
SCR: DD17.3(1.1) DD46.15(Q6) DD51.11(IOA3)
SID: DD41A.5.10(2) XP2.32
STB: DD61.2 R42.1 XP1.A16(16)
STP: DD55.4(S) DD61.12(2) XP2.20
SYNC: R20.1 VT2.2(C) XP1.A28(28) XP3.8(SN)
T_IN: C13.2 XP1.A25(25)
T_OUT: C11.1 XP1.B25(25)
TIN: DD37.14(4.0) DD70.8(O) DD70.10(O)
TM9: DD57.9(C) DD65.12(Y3)
TR0: DD60.34(-TR0) R78.1 XP2.26
TRB: DD9.8(-Q) DD9.12(D) DD30.8(IN)
TX: DD47.15(Q6) R43.1
TxD: R79.2 R82.2 XP1.B28(28)
VF: DD55.1(R) DD60.33(-VFOE) R88.2
VIDEO: R8.1 XP1.A30(30) XP3.10(V)
WAIT-: DD20.24(-WAIT) R23.1 VD2.1(A) XP4.A21(21) XP5.A21(21)
WE-: DD21.3(WE) DD22.3(WE) DD23.3(WE) DD24.3(WE) DD25.3(WE) DD26.3(WE) DD27.3(WE) DD28.3(WE) DD30.19(I/O) R36.1
WPG: DD61.8(2) XP2.24
WR-: DD10.3(2) DD14.9(1) DD20.22(-WR) DD52.1(A1) DD60.2(-WR) DD65.3(A3) XP4.A19(19) XP5.A19(19)
WR_1FFD: DD47.9(C) DD52.15(Y0)
WR_7FFD: DD45.15(E2) DD52.13(Y2)
WR_BFFD: DD48.1 DD52.11(Y4)
WR_EN: DD30.5(IN) DD67.8(O)
WR_FFFD: DD48.2 DD48.4(1) DD52.9(Y6)
WRBFR-: DD30.16(I/O) DD38.11(C)
WRFE: DD10.1(3) DD35.9(C)
WRP: DD60.36(-WRPT) R90.1 VD17.2(K) XP2.28
WRPRT-: DD14.8(3) DD58.11(C)
Y: DD43.9(3) R17.2 R18.2 R19.2 XP3.7(Y)
Net-(C2-1): C2.1 DD9.10(S) DD52.12(Y3)
Net-(C3-1): C3.1 DD9.13(R) DD52.14(Y1)
Net-(C11-2): C11.2 C12.2 R37.2 R38.1 R55.1
Net-(C12-1): C12.1 R66.1
Net-(C13-1): C13.1 R39.2
Net-(C17-2): C17.2 DD50.4(S) R64.2
Net-(C18-1): C18.1 DD60.31(WD) DD62.6(EL)
Net-(C21-1): C21.1 R85.2 VT10.1(E)
Net-(DD1.2-3): DD1.3(1) R35.1 ZQ1.2(OSC2)
Net-(DD1.2-4): DD1.4(2) DD1.5(1) R34.1 R35.2
Net-(DD1.6-12): DD1.12(2) DD42.1(R)
Net-(DD3-12): DD3.12(-P) DD4.5(C1)
Net-(DD4-11): DD4.11(-V) DD14.6(3)
Net-(DD4-12): DD4.12(-P) DD8.3(С) DD14.5(2)
Net-(DD5-11): DD5.11(-V) DD6.11(-V) DD8.11(C) DD12.8(3)
Net-(DD5-12): DD5.12(-P) DD6.5(C1)
Net-(DD7.1-6): DD7.6(Q3) DD7.10(CE)
Net-(DD8.1-2): DD8.2(D) DD8.6(&#126;Q) DD14.4(1) DD31.3(I1)
Net-(DD8.2-8): DD8.8(-Q) DD8.12(D) DD13.2
Net-(DD9.1-4): DD9.4(S) DD69.3
Net-(DD9.2-9): DD9.9(Q) R86.1
Net-(DD9.2-11): DD9.11(C) DD55.8(-Q)
Net-(DD10.1-2): DD10.2(1) DD32.9(Y6) DD66.12(1)
Net-(DD10.2-4): DD10.4(3) DD62.3(D2)
Net-(DD10.2-5): DD10.5(1) DD60.18(SR) DD62.2(D1)
Net-(DD10.2-6): DD10.6(2) DD60.17(SL) DD62.4(D3)
Net-(DD11.1-2): DD11.2 R54.1 VD3.1(A) VD4.1(A)
Net-(DD11.1-3): DD11.3 DD43.1(SE)
Net-(DD11.2-6): DD11.6(3) DD64.2(C)
Net-(DD12.4-11): DD12.11(3) DD67.11(I3)
Net-(DD13.1-3): DD13.3 DD31.11(I3)
Net-(DD13.3-8): DD13.8(3) DD18.3(1.1)
Net-(DD13.4-11): DD13.11(3) DD65.6(E3)
Net-(DD14.1-1): DD14.1 DD66.11(3)
Net-(DD14.1-3): DD14.3 DD66.2
Net-(DD14.3-10): DD14.10(2) DD32.14(Y1)
Net-(DD14.4-11): DD14.11(3) DD53.1(EZ)
Net-(DD18-6): DD18.6(2.1) DD19.12(4)
Net-(DD18-10): DD18.10(3.1) DD19.9(2)
Net-(DD18-13): DD18.13(4.1) DD19.7(1)
Net-(DD30-21): DD30.21(I/O) VD2.2(K)
Net-(DD32-4): DD32.4(E1) DD66.8(3)
Net-(DD32-7): DD32.7(Y7) DD68.9(1)
Net-(DD32-12): DD32.12(Y3) DD66.13(2)
Net-(DD35-2): DD35.2(Q1) R55.2
Net-(DD35-7): DD35.7(Q3) R38.2
Net-(DD39-13): DD39.13(DO) DD40.1(D0)
Net-(DD41A.5-11): DD41A.5.11(1) DD57.12(Q5)
Net-(DD42.1-3): DD42.3(С) DD42.8(-Q) DD43.15(E)
Net-(DD42.1-5): DD42.5(Q) R21.2
Net-(DD44-1): DD44.1(A/B) DD48.11(3)
Net-(DD44-12): DD44.12(4) DD45.4(1.2)
Net-(DD45-9): DD45.9(2) DD46.9(C) R65.2
Net-(DD45-10): DD45.10(2.0) DD45.11(2.1) DD45.12(2.2) DD45.13(2.3) DD46.12(Q5)
Net-(DD47-2): DD47.2(Q1) R63.1
Net-(DD47-5): DD47.5(Q2) DD68.13(1)
Net-(DD47-12): DD47.12(Q5) DD61.1
Net-(DD49-3): DD49.3 DD67.12(O)
Net-(DD49-8): DD49.8 R64.1
Net-(DD50.1-2): DD50.2(D) DD50.8(-Q)
Net-(DD50.2-9): DD50.9(Q) R56.2
Net-(DD51-1): DD51.1(ACC) R68.2
Net-(DD51-4): DD51.4(ACB) J3.1 J4.1
Net-(DD51-5): DD51.5(ACA) J1.1 J2.1
Net-(DD54-2): DD54.2(Q1) DD59.7(I6)
Net-(DD54-5): DD54.5(Q2) DD59.8(I7)
Net-(DD54-7): DD54.7(Q3) DD59.9(I8)
Net-(DD54-10): DD54.10(Q4) DD56.3(С) DD59.6(I5)
Net-(DD54-13): DD54.13(D5) DD56.8(-Q)
Net-(DD54-15): DD54.15(Q6) DD56.13(R)
Net-(DD55.1-6): DD55.6(&#126;Q) DD69.1
Net-(DD55.2-12): DD55.12(D) R87.1 SW1.2
Net-(DD56.2-11): DD56.11(C) DD63.8(3) R74.1
Net-(DD57-5): DD57.5(Q2) DD63.4(1) DD63.5(2) DD63.12(1)
Net-(DD57-7): DD57.7(Q3) DD60.19(-CLR)
Net-(DD57-10): DD57.10(Q4) DD60.23(RDY) VD5.2(K)
Net-(DD57-15): DD57.15(Q6) DD60.37(-DEN)
Net-(DD60-15): DD60.15(STP) DD61.13(1)
Net-(DD60-16): DD60.16(DIR) DD61.11(1)
Net-(DD60-28): DD60.28(HLD) DD60.32(CRDY) DD61.3(1) DD63.2 DD63.13(2)
Net-(DD60-30): DD60.30(WG) VD18.2(K)
Net-(DD61.3-5): DD61.5(1) DD62.10(4)
Net-(DD61.4-9): DD61.9(1) R25.1 VD17.1(A) VD18.1(A)
Net-(DD63.1-1): DD63.1 DD63.6(3) R75.1
Net-(DD65-10): DD65.10(Y5) VD10.2(K)
Net-(DD65-14): DD65.14(Y1) VD9.2(K)
Net-(DD66.2-4): DD66.4(1) DD68.12(2) DD69.13(2)
Net-(DD68.4-8): DD68.8(2) DD69.10(2)
Net-(DD68.5-10): DD68.10(2) DD69.5(2)
Net-(DD70.1-1): DD70.1(I) R39.1 R40.2
Net-(DD70.1-2): DD70.2(O) R40.1 R41.2
Net-(DD70.2-3): DD70.3(I) R41.1
Net-(DD70.2-4): DD70.4(O) DD70.5(I)
Net-(DD70.3-6): DD70.6(O) DD70.9(I) DD70.11(I)
Net-(J1-2): J1.2 J3.2 R73.2
Net-(J2-2): J2.2 J4.2 R69.2 R72.2
Net-(L1-1): L1.1 VD6.1(A) VT10.2(C)
Net-(R1-2): R1.2 R2.2 R13.1 VT5.1(E)
Net-(R3-2): R3.2 R4.2 R11.1 VT6.1(E)
Net-(R5-2): R5.2 R6.2 R12.1 VT4.1(E)
Net-(R7-2): R7.2 R8.2 VT3.1(E)
Net-(R9-1): R9.1 R10.2 R11.2 R12.2 R13.2 VT1.2(C) VT3.3(B)
Net-(R14-1): R14.1 VD11.1(A) VT4.3(B)
Net-(R15-1): R15.1 VD12.1(A) VT5.3(B)
Net-(R16-1): R16.1 VD13.1(A) VT6.3(B)
Net-(R17-1): R17.1 VD11.2(K)
Net-(R18-1): R18.1 VD12.2(K)
Net-(R19-1): R19.1 VD13.2(K)
Net-(R21-1): R21.1 VT1.3(B) VT2.3(B)
Net-(R43-2): R43.2 VT7.3(B)
Net-(R60-2): R60.2 VT10.3(B)
Net-(R62-1): R62.1 R80.2 VT9.3(B)
Net-(R80-1): R80.1 VT7.2(C)
Net-(R82-1): R82.1 VT9.2(C)
Net-(R86-2): R86.2 VD8.1

Not connected (* = marked no-connect by the designer): DD1 7(GND) 14(VCC); DD2 7(GND) 8(&#126;Q)* 14(VCC); DD3 8(GND) 13(-B)* 16(VCC); DD4 8(GND) 13(-B)* 16(VCC); DD5 8(GND) 13(-B)* 16(VCC); DD6 8(GND) 12(-P)* 13(-B)* 16(VCC); DD7 3(Q0)* 4(Q1)* 5(Q2)* 8(GND) 12(Q1)* 13(Q2)* 14(Q3)* 16(VCC); DD8 7(GND) 14(VCC); DD9 6(&#126;Q)* 7(GND) 14(VCC); DD10 7(GND) 14(VCC); DD11 7(GND) 14(VCC); DD12 7(GND) 14(VCC); DD13 7(GND) 14(VCC); DD14 7(GND) 14(VCC); DD15 8(GND) 16(VCC); DD16 8(GND) 16(VCC); DD17 8(GND) 16(VCC); DD18 8(GND) 16(VCC); DD19 8(GND) 16(VCC); DD20 11(VCC) 29(GND); DD21 8(VCC) 16(GND); DD22 8(VCC) 16(GND); DD23 8(VCC) 16(GND); DD24 8(VCC) 16(GND); DD25 8(VCC) 16(GND); DD26 8(VCC) 16(GND); DD27 8(VCC) 16(GND); DD28 8(VCC) 16(GND); DD30 2(IN)* 15(I/O)* 18(I/O)* 23(I/O)*; DD31 7(GND) 14(VCC); DD32 8(GND) 11(Y4)* 13(Y2)* 15(Y0)* 16(VCC); DD33 8(GND) 16(VCC); DD34 8(GND) 16(VCC); DD35 8(GND) 12(Q5)* 16(VCC); DD36 8(GND) 16(VCC); DD37 8(GND) 16(VCC); DD38 10(GND) 20(VCC); DD39 8(GND) 16(VCC); DD40 7(GND) 11(3)* 12(2)* 13(1)* 14(VCC); DD41 13(IN)* 14(I/O)* 16(I/O)*; DD41A.1 1* 2* 7(GND) 14(VCC); DD41B.1 7(GND) 14(VCC); DD42 6(&#126;Q)* 7(GND) 9(Q)* 14(VCC); DD43 8(GND) 16(VCC); DD44 8(GND) 16(VCC); DD45 8(GND) 16(VCC); DD46 8(GND) 16(VCC); DD47 7(Q3)* 8(GND) 16(VCC); DD48 7(GND) 14(VCC); DD49 7(GND) 14(VCC); DD50 7(GND) 14(VCC); DD51 3(VCC) 6(GND) 7(IOA7)* 8(IOA6)*; DD52 8(GND) 10(Y5)* 16(VCC); DD53 10(GND) 20(VCC); DD54 8(GND) 16(VCC); DD55 5(Q)* 7(GND) 9(Q)* 14(VCC); DD56 5(Q)* 7(GND) 9(Q)* 14(VCC); DD57 2(Q1)* 8(GND) 16(VCC); DD58 10(GND) 20(VCC); DD59 1(I/CLK)* 2(I1)* 3(I2)* 4(I3)* 10(GND) 11(I9/OE-)* 16(I/O)* 17(I/O)* 18(I/O)* 19(I/O)*; DD60 20(GND) 21(VCC) 29(T43)*; DD61 7(GND) 14(VCC); DD62 7(GND) 11(3)* 12(2)* 13(1)* 14(VCC); DD63 7(GND) 14(VCC); DD64 8(GND) 15(P2)* 16(VCC); DD65 8(GND) 9(Y6)* 11(Y4)* 13(Y2)* 15(Y0)* 16(VCC); DD66 7(GND) 14(VCC); DD67 7(GND) 14(VCC); DD68 1* 2* 7(GND) 14(VCC); DD69 7(GND) 14(VCC); DD70 7(GND) 14(VCC); XP1 A9(9)* A10(10)* B10(10)*; XP2 2* 4* 6* 14* 34*; XP4 A5(5)* A20(20)* A23(23)* A28(28)* A29(29)* B5(5)* B16(16)* B17(17)* B18(18)* B29(29)*; XP5 A5(5)* A20(20)* A23(23)* A28(28)* A29(29)* B5(5)* B16(16)* B17(17)* B18(18)* B29(29)*

## Notes on the sheet
- R33 можно уменьшить до 560 Ом при использовании nMOS процессора
- 1-Экран
  0-Бордюр
- Чтение ПЗУ
- ProfROM
- Чтение памяти
- Чтение ОЗУ
- 1-Выбор ПЗУ, 0-ОЗУ
- Scorpion ZS 256 Turbo+
- С доработками, описанными
  в теме: https://zx-pk.ru/threads/9195-scorpion-zs-256-turbo-restored.html
  в Телеграм чате: https://t.me/zs_scorpion
- Триггер выбора
  1-DOS
  0-SOS
- Селектор окна
  C000-FFFF
- Мультиплексор старшего
  разряда адреса ОЗУ
- Селектор окна
  3D00 в ПЗУ
- Комутатор страниц ОЗУ
- Триггер кнопки
  Magic
- Блок записи в 7FFD
- 7FFD
- Переключение экранов
- Переключение ПЗУ 48/128
- 1FFD
- Блок ПЗУ
  0-3FFF
- J1,J4 ON - ABC Common
  J2,J3 ON - BAC Scorpion
- Дешифратор AY
- FF Аттрибуты экрана
